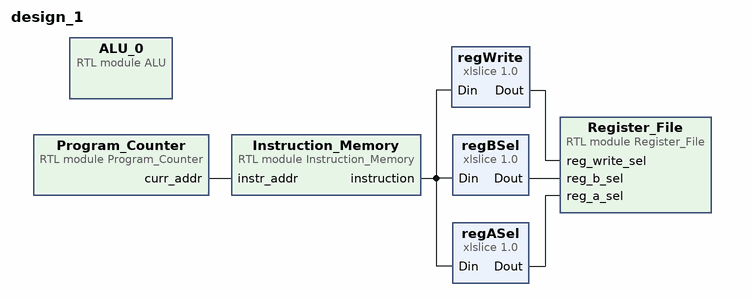
[diagram p0: block diagram of the top level]
# Vivado block design design_1, xc7s100fgga676-2, Vivado 2020.1
create_bd_design design_1

create_bd_cell -type module -reference ALU ALU_0
create_bd_cell -type module -reference Program_Counter Program_Counter
create_bd_cell -type module -reference Instruction_Memory Instruction_Memory
create_bd_cell -type module -reference Register_File Register_File
create_bd_cell -type ip -vlnv xilinx.com:ip:xlslice:1.0 regASel
set_property -dict {CONFIG.DIN_FROM 9 CONFIG.DIN_TO 5} [get_bd_cells regASel]
create_bd_cell -type ip -vlnv xilinx.com:ip:xlslice:1.0 regBSel
set_property -dict {CONFIG.DIN_FROM 20 CONFIG.DIN_TO 16} [get_bd_cells regBSel]
create_bd_cell -type ip -vlnv xilinx.com:ip:xlslice:1.0 regWrite
set_property -dict {CONFIG.DIN_FROM 4} [get_bd_cells regWrite]

# ---- connections ----

connect_bd_net -net Program_Counter_0_curr_addr [get_bd_pins Program_Counter/curr_addr] [get_bd_pins Instruction_Memory/instr_addr]
connect_bd_net [get_bd_pins Instruction_Memory/instruction] [get_bd_pins regASel/Din] [get_bd_pins regBSel/Din] [get_bd_pins regWrite/Din]
connect_bd_net [get_bd_pins regASel/Dout] [get_bd_pins Register_File/reg_a_sel]
connect_bd_net [get_bd_pins regBSel/Dout] [get_bd_pins Register_File/reg_b_sel]
connect_bd_net [get_bd_pins regWrite/Dout] [get_bd_pins Register_File/reg_write_sel]

validate_bd_design
save_bd_design
